# EAGLE design cap_touch (EAGLE 6.5.0)
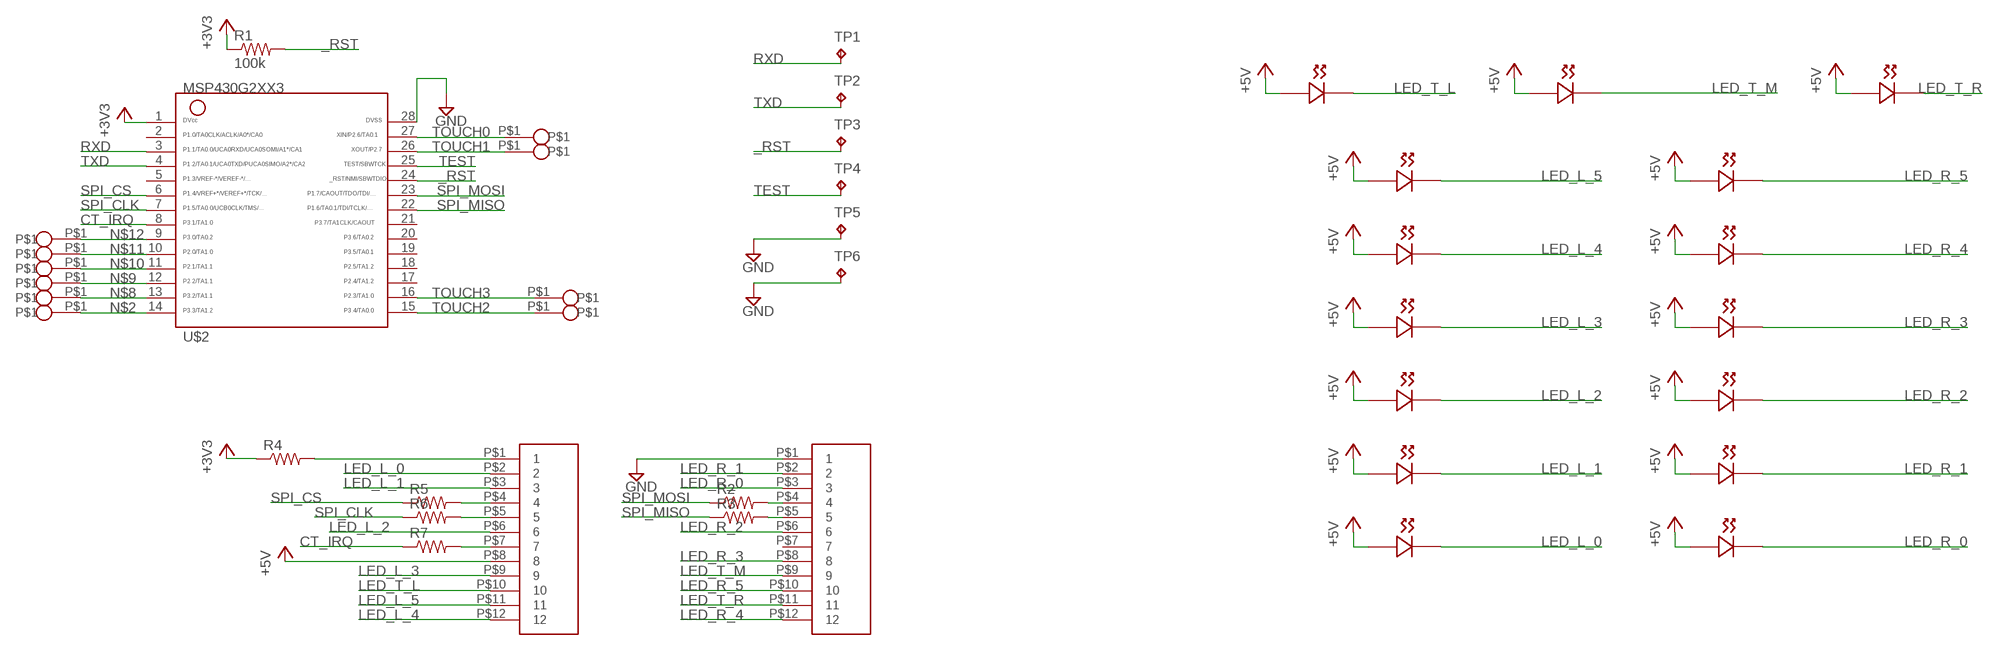
[diagram p0: schematic, sheet 1]

## Parts
R1  100k  RESISTOR0603-RES  [0603-RES]
R2  RESISTOR0805-RES  [0805]
R3  RESISTOR0805-RES  [0805]
R4  RESISTOR0805-RES  [0805]
R5  RESISTOR0805-RES  [0805]
R6  RESISTOR0805-RES  [0805]
R7  RESISTOR0805-RES  [0805]
TP1  TPTP18SQ  [TP18SQ]
TP2  TPTP18SQ  [TP18SQ]
TP3  TPTP18SQ  [TP18SQ]
TP4  TPTP18SQ  [TP18SQ]
TP5  TPTP18SQ  [TP18SQ]
TP6  TPTP18SQ  [TP18SQ]
U$1  12_PIN_SMT_HEADER  [SMT_12PIN_HEADER]
U$2  G2XX3---PW28  [PW28]
U$3  12_PIN_SMT_HEADER  [SMT_12PIN_HEADER]
U$8  597-6601-607F  [597-6601-607F]
U$9  597-6601-607F  [597-6601-607F]
U$10  597-6601-607F  [597-6601-607F]
U$11  597-6601-607F  [597-6601-607F]
U$12  597-6601-607F  [597-6601-607F]
U$13  597-6601-607F  [597-6601-607F]
U$14  597-6601-607F  [597-6601-607F]
U$15  597-6601-607F  [597-6601-607F]
U$16  597-6601-607F  [597-6601-607F]
U$17  597-6601-607F  [597-6601-607F]
U$18  597-6601-607F  [597-6601-607F]
U$19  597-6601-607F  [597-6601-607F]
U$20  597-6601-607F  [597-6601-607F]
U$21  597-6601-607F  [597-6601-607F]
U$22  597-6601-607F  [597-6601-607F]
U$25  VIA  [VIA]
U$26  VIA  [VIA]
U$27  VIA  [VIA]
U$28  VIA  [VIA]
U$29  VIA  [VIA]
U$30  VIA  [VIA]
U$31  VIA  [VIA]
U$32  VIA  [VIA]
U$33  VIA  [VIA]
U$34  VIA  [VIA]

## Nets
+3V3: R1.1 R4.1 U$2.1
+5V: U$1.P$8 U$8.+(R.POS) U$9.+(R.POS) U$10.+(R.POS) U$11.+(R.POS) U$12.+(R.POS) U$13.+(R.POS) U$14.+(R.POS) U$15.+(R.POS) U$16.+(R.POS) U$17.+(R.POS) U$18.+(R.POS) U$19.+(R.POS) U$20.+(R.POS) U$21.+(R.POS) U$22.+(R.POS)
_RST: R1.2 TP3.TP U$2.24
CT_IRQ: R7.1 U$2.8
GND: TP5.TP TP6.TP U$2.28 U$3.P$1
LED_L_0: U$1.P$2 U$21.-(R.NEG)
LED_L_1: U$1.P$3 U$19.-(R.NEG)
LED_L_2: U$1.P$6 U$17.-(R.NEG)
LED_L_3: U$1.P$9 U$15.-(R.NEG)
LED_L_4: U$1.P$12 U$13.-(R.NEG)
LED_L_5: U$1.P$11 U$11.-(R.NEG)
LED_R_0: U$3.P$3 U$22.-(R.NEG)
LED_R_1: U$3.P$2 U$20.-(R.NEG)
LED_R_2: U$3.P$6 U$18.-(R.NEG)
LED_R_3: U$3.P$8 U$16.-(R.NEG)
LED_R_4: U$3.P$12 U$14.-(R.NEG)
LED_R_5: U$3.P$10 U$12.-(R.NEG)
LED_T_L: U$1.P$10 U$8.-(R.NEG)
LED_T_M: U$3.P$9 U$9.-(R.NEG)
LED_T_R: U$3.P$11 U$10.-(R.NEG)
N$1: R4.2 U$1.P$1
N$2: U$2.14 U$29.P$1
N$3: R2.2 U$3.P$4
N$4: R3.2 U$3.P$5
N$5: R5.2 U$1.P$4
N$6: R6.2 U$1.P$5
N$7: R7.2 U$1.P$7
N$8: U$2.13 U$30.P$1
N$9: U$2.12 U$31.P$1
N$10: U$2.11 U$32.P$1
N$11: U$2.10 U$33.P$1
N$12: U$2.9 U$34.P$1
RXD: TP1.TP U$2.3
SPI_CLK: R6.1 U$2.7
SPI_CS: R5.1 U$2.6
SPI_MISO: R3.1 U$2.22
SPI_MOSI: R2.1 U$2.23
TEST: TP4.TP U$2.25
TOUCH0: U$2.27 U$26.P$1
TOUCH1: U$2.26 U$25.P$1
TOUCH2: U$2.15 U$28.P$1
TOUCH3: U$2.16 U$27.P$1
TXD: TP2.TP U$2.4
Unconnected: U$2.2 U$2.5 U$2.17 U$2.18 U$2.19 U$2.20 U$2.21 U$3.P$7

## Library data of the parts
R1 = SparkFun-Passives:RESISTOR: Resistor Basic schematic elements and footprints for 0603, 1206, and PTH resistors.
R2-R7 = SparkFun-Resistors:RESISTOR: Resistor Basic schematic elements and footprints for 0603, 1206, and PTH resistors.
TP1-TP6 = testpad:TP: Test pad
U$1 U$3 = smart_switch:12_PIN_SMT_HEADER
U$2 = TI_MSP430_v16:G2XX3---PW28: MSP430G2XX1 TSSOP (PW) 28 Pin Package
U$8-U$22 = smart_switch:597-6601-607F
U$25-U$34 = smart_switch:VIA

## Board
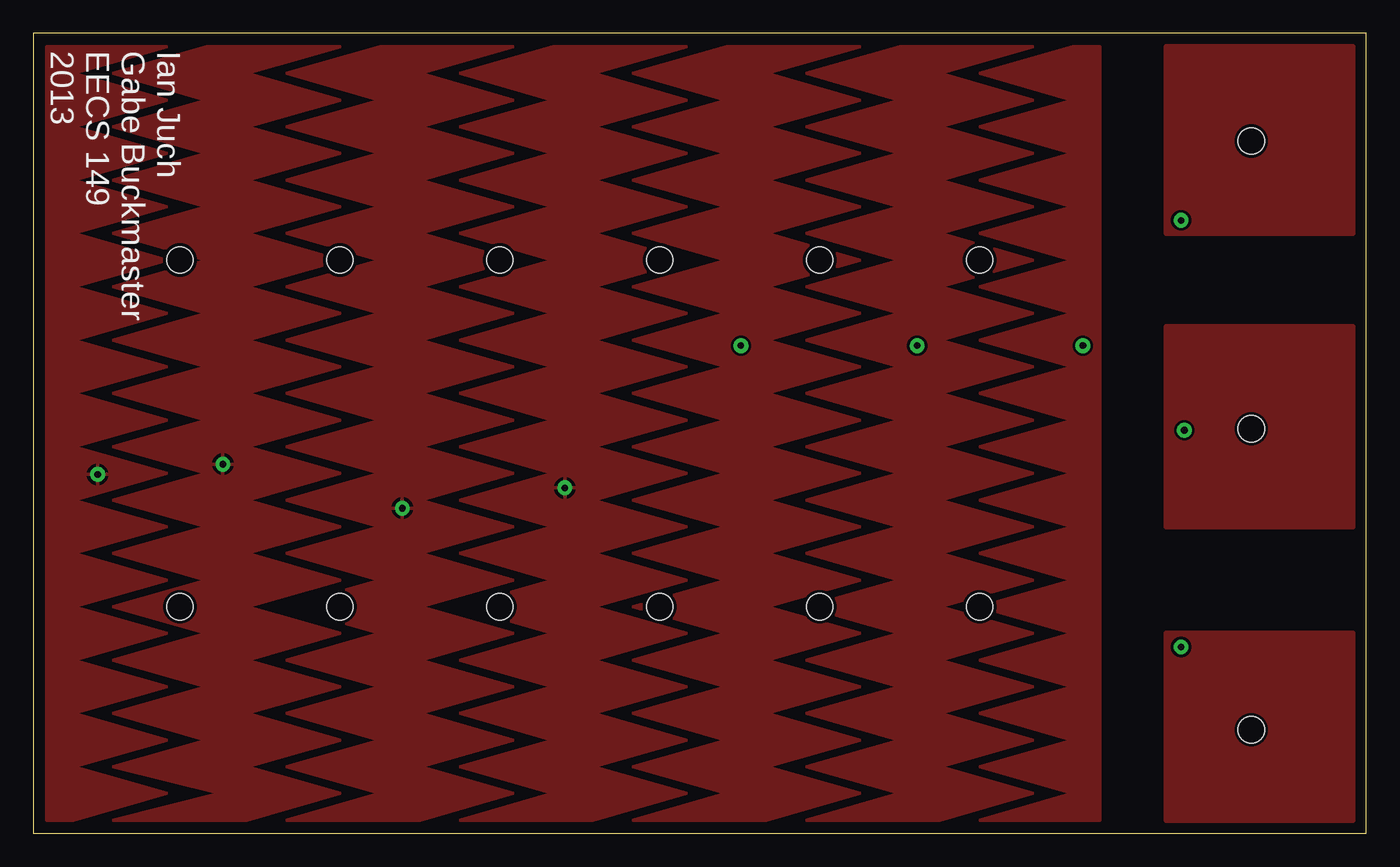
[diagram p1: board, top side]
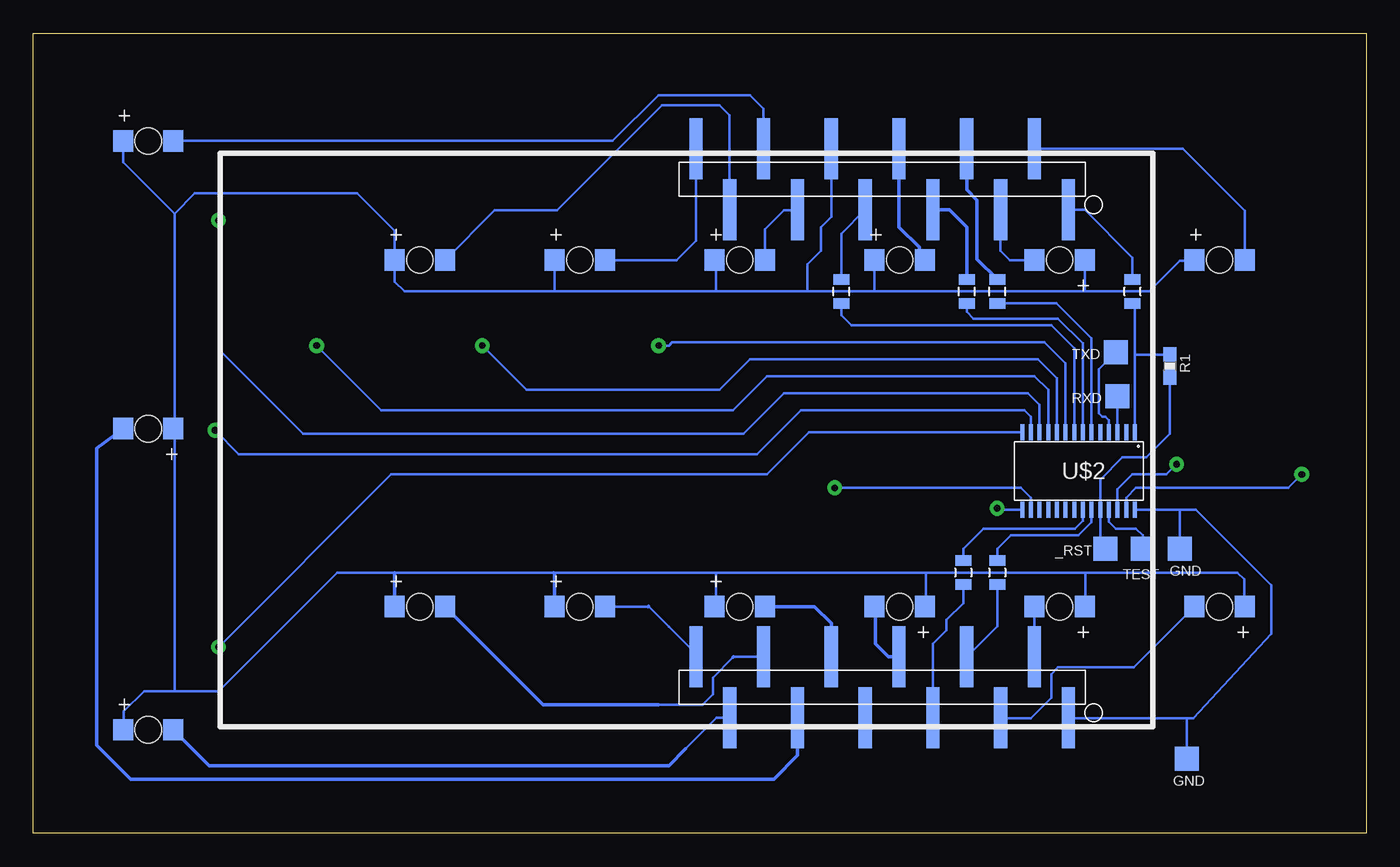
[diagram p2: board, bottom side, seen from below]

Size 100 x 60 mm. Coordinates in mm from the lower left corner, seen from the top.
Outline: 0,0 100,0 100,60 0,60 0,0
Copper layers (1*16): Top 0.035mm / dielectric 1.5mm / Bottom 0.035mm
Design rules "SparkFun": minimum track width 8mil, minimum drill 20mil, track to track 8mil, track to pad 8mil, pad to pad 8mil, via to via 8mil, smd to smd 8mil, copper to edge 10mil, drill to drill 8mil, minimum pad ring 12mil, minimum via ring 10mil, stop-mask expansion 4mil, vias tented up to drill 25mil, thermal gap 10mil

### Footprints (pad centres in the part's own frame; a part is rotated, then mirrored left to right if it is on the bottom)
0603-RES = smd 1.1 x 1: 1 -0.85,0; 2 0.85,0
0805 = smd 0.8 x 1.2: 1 -0.9,0; 2 0.9,0
TP18SQ = smd 1.8 x 1.8: TP 0,0
SMT_12PIN_HEADER = smd 0.991 x 4.572: P$1 0,2.286; P$2 2.54,-2.286; P$3 5.08,2.286; P$4 7.62,-2.286; P$5 10.16,2.286; P$6 12.7,-2.286; P$7 15.24,2.286; P$8 17.78,-2.286; P$9 20.32,2.286; P$10 22.86,-2.286; P$11 25.4,2.286; P$12 27.94,-2.286
PW28 = smd 0.3 x 1.2: 1 -4.229,-2.908; 2 -3.579,-2.908; 3 -2.929,-2.908; 4 -2.279,-2.908; 5 -1.629,-2.908; 6 -0.979,-2.908; 7 -0.329,-2.908; 8 0.321,-2.908; 9 0.971,-2.908; 10 1.621,-2.908; 11 2.271,-2.908; 12 2.921,-2.908; 13 3.571,-2.908; 14 4.221,-2.908; 15 4.221,2.892; 16 3.571,2.892; 17 2.921,2.892; 18 2.271,2.892; 19 1.621,2.892; 20 0.971,2.892; 21 0.321,2.892; 22 -0.329,2.892; 23 -0.979,2.892; 24 -1.629,2.892; 25 -2.279,2.892; 26 -2.929,2.892; 27 -3.579,2.892; 28 -4.229,2.892
597-6601-607F = smd 1.499 x 1.6 bottom: + -1.882,0; - 1.882,0 | hole 1.981: 0,0
VIA = drill 0.5: P$1 0,0

### Placement (x,y rotation side)
R1  14.73,35.05 270 bottom
R2  27.69,19.56 270 bottom
R3  30.23,19.56 270 bottom
R4  17.53,40.64 90 bottom
R5  27.69,40.64 90 bottom
R6  29.97,40.64 90 bottom
R7  39.37,40.64 90 bottom
TP1  18.67,32.77 0 bottom
TP2  18.8,36.07 0 bottom
TP3  19.56,21.34 0 bottom
TP4  16.76,21.34 0 bottom
TP5  13.97,21.34 0 bottom
TP6  13.46,5.59 0 bottom
U$1  22.35,49.05 180 bottom
U$2  21.59,27.18 180 bottom
U$3  22.35,10.95 180 bottom
U$8  91.39,51.93 180 top
U$9  91.39,30.35 0 top
U$10  91.39,7.77 180 top
U$11  71,43 180 top
U$12  71,17 180 top
U$13  59,43 180 top
U$14  59,17 180 top
U$15  47,43 180 top
U$16  47,17 180 top
U$17  35,43 180 top
U$18  35,17 0 top
U$19  23,43 0 top
U$20  23,17 0 top
U$21  11,43 180 top
U$22  11,17 0 top
U$25  14.22,27.69 0 top
U$26  4.83,26.92 0 top
U$27  39.88,25.91 0 top
U$28  27.69,24.38 0 top
U$29  86.11,13.97 0 top
U$30  86.36,30.23 0 top
U$31  86.11,45.97 0 top
U$32  78.74,36.58 0 top
U$33  66.31,36.58 0 top
U$34  53.09,36.58 0 top

### Tracks (layer width: path | path; a pad name or v marks a point on that pad's centre or on a via)
+3V3
  Bottom 0.203: U$2.1 17.36,35.81 | 17.36,35.81 17.36,39.58 R4.1 | R1.1 17.27,35.9 17.36,35.81
+5V
  Bottom 0.203: U$22.+ 9.14,17.03 9.14,19.05 9.65,19.56 21.08,19.56 | 21.08,19.56 33.02,19.56 | 33.02,19.56 48.77,19.56 | 48.77,19.56 60.96,19.56 72.9,19.56 77.22,19.56 86.11,10.67 89.41,10.67 | U$18.+ 33.02,17.1 33.02,19.56 | U$20.+ 21.08,17.04 21.08,19.56 | 21.08,40.64 16.26,40.64 13.97,42.93 12.96,42.93 U$21.+ | 21.08,40.64 36.83,40.64 | 36.83,40.64 41.91,40.64 | 41.91,40.64 48.77,40.64 | 48.77,40.64 60.96,40.64 | 60.96,40.64 72.14,40.64 72.88,41.39 U$11.+ | U$13.+ 60.88,40.72 60.96,40.64 | U$11.+ 72.64,42.76 | U$15.+ 48.77,42.89 48.77,40.64 | 36.83,40.64 36.88,40.69 U$17.+ | U$19.+ 21.12,40.86 21.08,40.64 | U$16.+ 48.77,17.11 48.77,19.56 | 89.41,46.48 93.27,50.35 U$8.+ | 89.41,10.67 91.69,10.67 93.22,9.14 93.22,7.82 U$10.+ | 89.41,10.67 89.41,30.25 U$9.+ 89.41,30.45 89.41,46.48 | U$11.+ 72.88,45.2 75.69,48.01 87.88,48.01 89.41,46.48 | U$1.P$8 40.13,46.23 40.89,45.47 40.89,43.69 41.91,42.67 41.91,40.64
  Bottom 0.254: U$12.+ 72.88,19.54 72.9,19.56 | U$14.+ 60.88,19.48 60.96,19.56
_RST
  Bottom 0.203: 14.73,34.04 R1.2 14.73,29.97 16.51,28.19 18.29,28.19 19.96,26.52 U$2.24 19.96,21.74 TP3.TP
CT_IRQ
  Bottom 0.203: U$2.8 21.91,36.39 23.62,38.1 38.61,38.1 39.37,38.86 R7.1
GND
  Bottom 0.203: 13.46,8.64 12.95,8.64 7.11,14.99 7.11,18.61 12.79,24.29 13.97,24.29 | 13.46,8.64 22.32,8.64 U$3.P$1 | U$2.28 13.97,24.29 | TP6.TP 13.46,8.64 | TP5.TP 13.97,24.29
LED_L_0
  Bottom 0.203: U$21.- 9.12,46.71 13.74,51.34 U$1.P$2
LED_L_1
  Bottom 0.203: U$19.- 26.74,43 27.43,43.69 U$1.P$3
LED_L_2
  Bottom 0.203: U$17.- 33.53,43.41
  Bottom 0.254: 33.53,43.41 33.53,43.94 35.05,45.47 35.05,48.77 U$1.P$6
LED_L_3
  Bottom 0.203: U$15.- 45.12,45.31 43.69,46.74 42.7,46.74 U$1.P$9
LED_L_4
  Bottom 0.203: U$13.- 51.74,43 50.29,44.45 U$1.P$12
LED_L_5
  Bottom 0.203: U$11.- 65.38,46.74 60.71,46.74 52.83,54.61 48.51,54.61 47.75,53.85 U$1.P$11
LED_R_0
  Bottom 0.203: U$22.- 17.44,12.45 23.11,12.45 23.62,11.94 23.62,10.16 25.15,8.64 27.4,8.64 U$3.P$3
LED_R_1
  Bottom 0.203: 24.89,16.99 U$3.P$2
  Bottom 0.254: U$20.- 24.89,16.99
LED_R_2
  Bottom 0.254: U$18.- 36.83,16.95 36.83,14.22 35.84,13.24 U$3.P$6
LED_R_3
  Bottom 0.254: U$16.- 41.38,17 40.13,15.75 U$3.P$8
LED_R_4
  Bottom 0.203: U$14.- 53.87,17 | 53.85,17.02 52.32,15.49 50.29,13.46 U$3.P$12
  Bottom 0.254: 53.87,17 53.85,17.02
LED_R_5
  Bottom 0.203: 53.09,9.65 49.78,9.65 49.02,10.41 49.02,11.68 47.5,13.21 | 47.47,13.24 U$3.P$10
  Bottom 0.254: U$12.- 61.77,9.65 53.09,9.65 | 47.5,13.21 47.47,13.24
LED_T_L
  Bottom 0.203: U$8.- 56.53,51.93 53.09,55.37 46.23,55.37 45.21,54.36 U$1.P$10
LED_T_M
  Bottom 0.254: U$9.- 95.25,28.87 95.25,6.6 92.71,4.06 44.45,4.06 42.67,5.84 U$3.P$9
LED_T_R
  Bottom 0.203: 51.05,6.35 48.74,8.66 U$3.P$11
  Bottom 0.254: U$10.- 86.82,5.08 52.32,5.08 51.05,6.35
N$1
  Bottom 0.203: R4.2 17.53,43.18 21.11,46.76 U$1.P$1
N$2
  Bottom 0.203: U$2.14 41.8,30.09 44.96,26.92 73.15,26.92 U$29.P$1
N$3
  Bottom 0.203: R2.2 27.69,15.52 U$3.P$4
N$4
  Bottom 0.203: R3.2 30.23,17.27 31.5,16 31.5,15.24 32.51,14.22 U$3.P$5
N$5
  Bottom 0.254: R5.2 29.21,43.06 29.21,47.5 29.97,48.26 U$1.P$4
N$6
  Bottom 0.254: R6.2 29.97,45.47 31.27,46.76 U$1.P$5
N$7
  Bottom 0.203: R7.2 39.37,44.98 U$1.P$7
N$8
  Bottom 0.203: U$30.P$1 84.58,28.45 45.72,28.45 42.42,31.75 25.65,31.75 25.16,31.26 U$2.13
N$9
  Bottom 0.203: U$31.P$1 86.11,36.32 79.76,29.97 46.74,29.97 43.69,33.02 25.4,33.02 24.51,32.13 U$2.12
N$10
  Bottom 0.203: U$2.11 23.86,33.26 24.89,34.29 44.96,34.29 47.5,31.75 73.91,31.75 U$32.P$1
N$11
  Bottom 0.203: U$2.10 23.21,34.13 24.64,35.56 46.23,35.56 48.51,33.27 63.01,33.27 U$33.P$1
N$12
  Bottom 0.203: U$2.9 22.56,35.26 24.13,36.83 52.07,36.83 52.32,36.58 U$34.P$1
RXD
  Bottom 0.203: U$2.3 18.66,32.63 TP1.TP
SPI_CLK
  Bottom 0.203: U$2.7 21.26,36.76 23.11,38.61 29.46,38.61 29.97,39.12 R6.1
SPI_CS
  Bottom 0.203: U$2.6 20.61,37.12 23.23,39.74 R5.1
SPI_MISO
  Bottom 0.203: U$2.22 21.26,23.44 21.84,22.86 28.7,22.86 30.23,21.34 R3.1
SPI_MOSI
  Bottom 0.203: U$2.23 20.61,23.33 21.59,22.35 26.67,22.35 27.69,21.34 R2.1
TEST
  Bottom 0.203: U$2.25 19.31,23.38 18.8,22.86 17.27,22.86 16.76,22.35 TP4.TP
TOUCH0
  Bottom 0.203: U$2.27 18.01,25.17 17.27,25.91 5.84,25.91 U$26.P$1
  pour Top: 1,59 10,59 3,57 10,55 3,53 10,51 3,49 10,47 3,45 10,43 3,41 10,39 3,37 10,35 3,33 10,31 3,29 10,27 3,25 10,23 3,21 10,19 3,17 10,15 3,13 10,11 3,9 10,7 3,5 10,3 3,1 1,1
TOUCH1
  Bottom 0.203: U$2.26 18.66,25.79 17.53,26.92 14.99,26.92 U$25.P$1
  pour Top: 23,59 16,57 23,55 16,53 23,51 16,49 23,47 16,45 23,43 16,41 23,39 16,37 23,35 16,33 23,31 16,29 23,27 16,25 23,23 16,21 23,19 16,17 23,15 16,13 23,11 16,9 23,7 16,5 23,3 16,1 6,1 14,3 6,5 13,7 6,9 13,11 6,13 13,15 6,17 13,19 6,21 13,23 6,25 13,27 6,29 13,31 6,33 13,35 6,37 13,39 6,41 13,43 6,45 13,47 6,49 13,51 6,53 13,55 6,57 13,59
TOUCH2
  Bottom 0.203: U$2.15 27.59,24.29 U$28.P$1
  pour Top: 26,59 19,57 26,55 19,53 26,51 19,49 26,47 19,45 26,43 19,41 26,39 19,37 26,35 19,33 26,31 19,29 26,27 19,25 26,23 19,21 26,19 19,17 26,15 19,13 26,11 19,9 26,7 19,5 26,3 19,1 29,1 36,3 29,5 36,7 29,9 36,11 29,13 36,15 29,17 36,19 29,21 36,23 29,25 36,27 29,29 36,31 29,33 36,35 29,37 36,39 29,41 36,43 29,45 36,47 29,49 36,51 29,53 36,55 29,57 36,59
TOUCH3
  Bottom 0.203: U$2.16 25.16,25.16 25.91,25.91 U$27.P$1
  pour Top: 32,1 39,3 32,5 39,7 32,9 39,11 32,13 39,15 32,17 39,19 32,21 39,23 32,25 39,27 32,29 39,31 32,33 39,35 32,37 39,39 32,41 39,43 32,45 39,47 32,49 39,51 32,53 39,55 32,57 39,59 49,59 42,57 49,55 42,53 49,51 42,49 49,47 42,45 49,43 42,41 49,39 42,37 49,35 42,33 49,31 42,29 49,27 42,25 49,23 42,21 49,19 42,17 49,15 42,13 49,11 42,9 49,7 42,5 49,3 42,1
TOUCH4
  pour Top: 45,1 55,1 62,3 55,5 62,7 55,9 62,11 55,13 62,15 55,17 62,19 55,21 62,23 55,25 62,27 55,29 62,31 55,33 62,35 55,37 62,39 55,41 62,43 55,45 62,47 55,49 62,51 55,53 62,55 55,57 62,59 52,59 45,57 52,55 45,53 52,51 45,49 52,47 45,45 52,43 45,41 52,39 45,37 52,35 45,33 52,31 45,29 52,27 45,25 52,23 45,21 52,19 45,17 52,15 45,13 52,11 45,9 52,7 45,5 52,3
TOUCH5
  pour Top: 75,59 68,57 75,55 68,53 75,51 68,49 75,47 68,45 75,43 68,41 75,39 68,37 75,35 68,33 75,31 68,29 75,27 68,25 75,23 68,21 75,19 68,17 75,15 68,13 75,11 68,9 75,7 68,5 75,3 68,1 58,1 65,3 58,5 65,7 58,9 65,11 58,13 65,15 58,17 65,19 58,21 65,23 58,25 65,27 58,29 65,31 58,33 65,35 58,37 65,39 58,41 65,43 58,45 65,47 58,49 65,51 58,53 65,55 58,57 65,59
TOUCH6
  pour Top: 80,1 80,59 78,59 71,57 78,55 71,53 78,51 71,49 78,47 71,45 78,43 71,41 78,39 71,37 78,35 71,33 78,31 71,29 78,27 71,25 78,23 71,21 78,19 71,17 78,15 71,13 78,11 71,9 78,7 71,5 78,3 71,1
TOUCH7
  pour Top: 99,59 85,59 85,45 99,45
TOUCH8
  pour Top: 85,38 99,38 99,23 85,23
TOUCH9
  pour Top: 99,1 85,1 85,15 99,15
TXD
  Bottom 0.203: U$2.4 19.31,31 19.56,31.24 19.81,31.24 20.07,31.5 20.07,34.8 TP2.TP

### Text on the board
tPlace: Ian Juch / Gabe Buckmaster / EECS 149 / 2013
bPlace: TXD | RXD | _RST | GND | TEST | GND